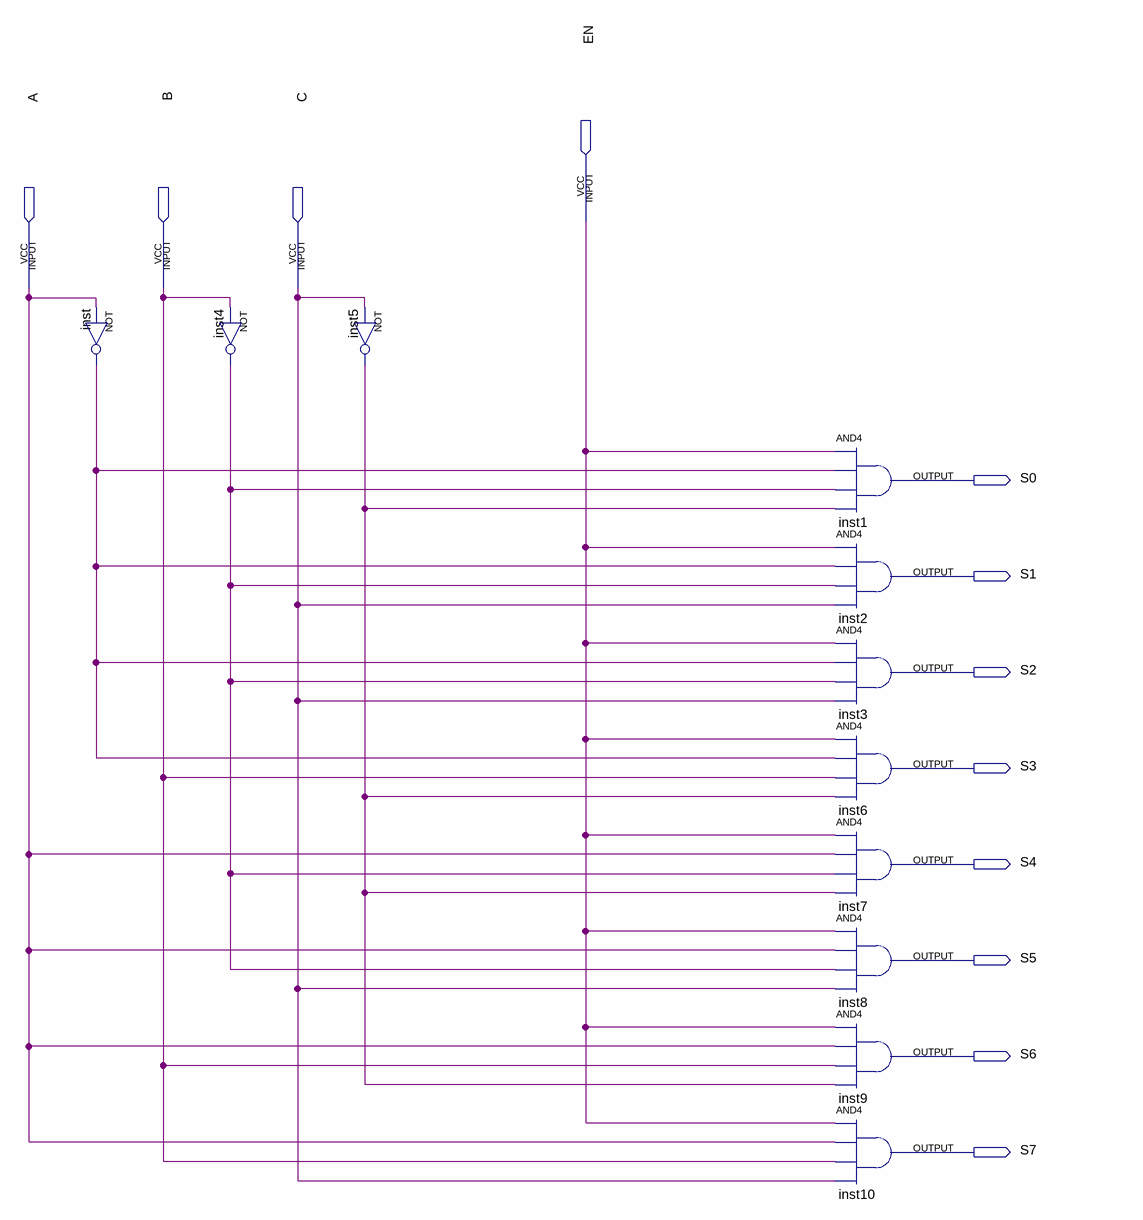
[diagram p0: schematic sheet]
// Quartus schematic DECODE3_8_EN.bdf as structural Verilog: 11 symbols, 12 pins
module DECODE3_8_EN (
  input  EN,
  input  A,
  input  B,
  input  C,
  output S0,
  output S1,
  output S2,
  output S3,
  output S4,
  output S5,
  output S6,
  output S7
);

  wire inst4_out, inst5_out, inst_out;

  not inst (inst_out, A);
  not inst4 (inst4_out, B);
  not inst5 (inst5_out, C);
  and inst1 (S0, EN, inst_out, inst4_out, inst5_out);
  and inst2 (S1, EN, inst_out, inst4_out, C);
  and inst3 (S2, EN, inst_out, inst4_out, C);
  and inst6 (S3, EN, inst_out, B, inst5_out);
  and inst7 (S4, EN, A, inst4_out, inst5_out);
  and inst8 (S5, EN, A, inst4_out, C);
  and inst9 (S6, EN, A, B, inst5_out);
  and inst10 (S7, EN, A, B, C);
endmodule
